# Altium schematic sheet STM32_QFP100_DEVELOPMENT_BOARD.SchDoc
size A4
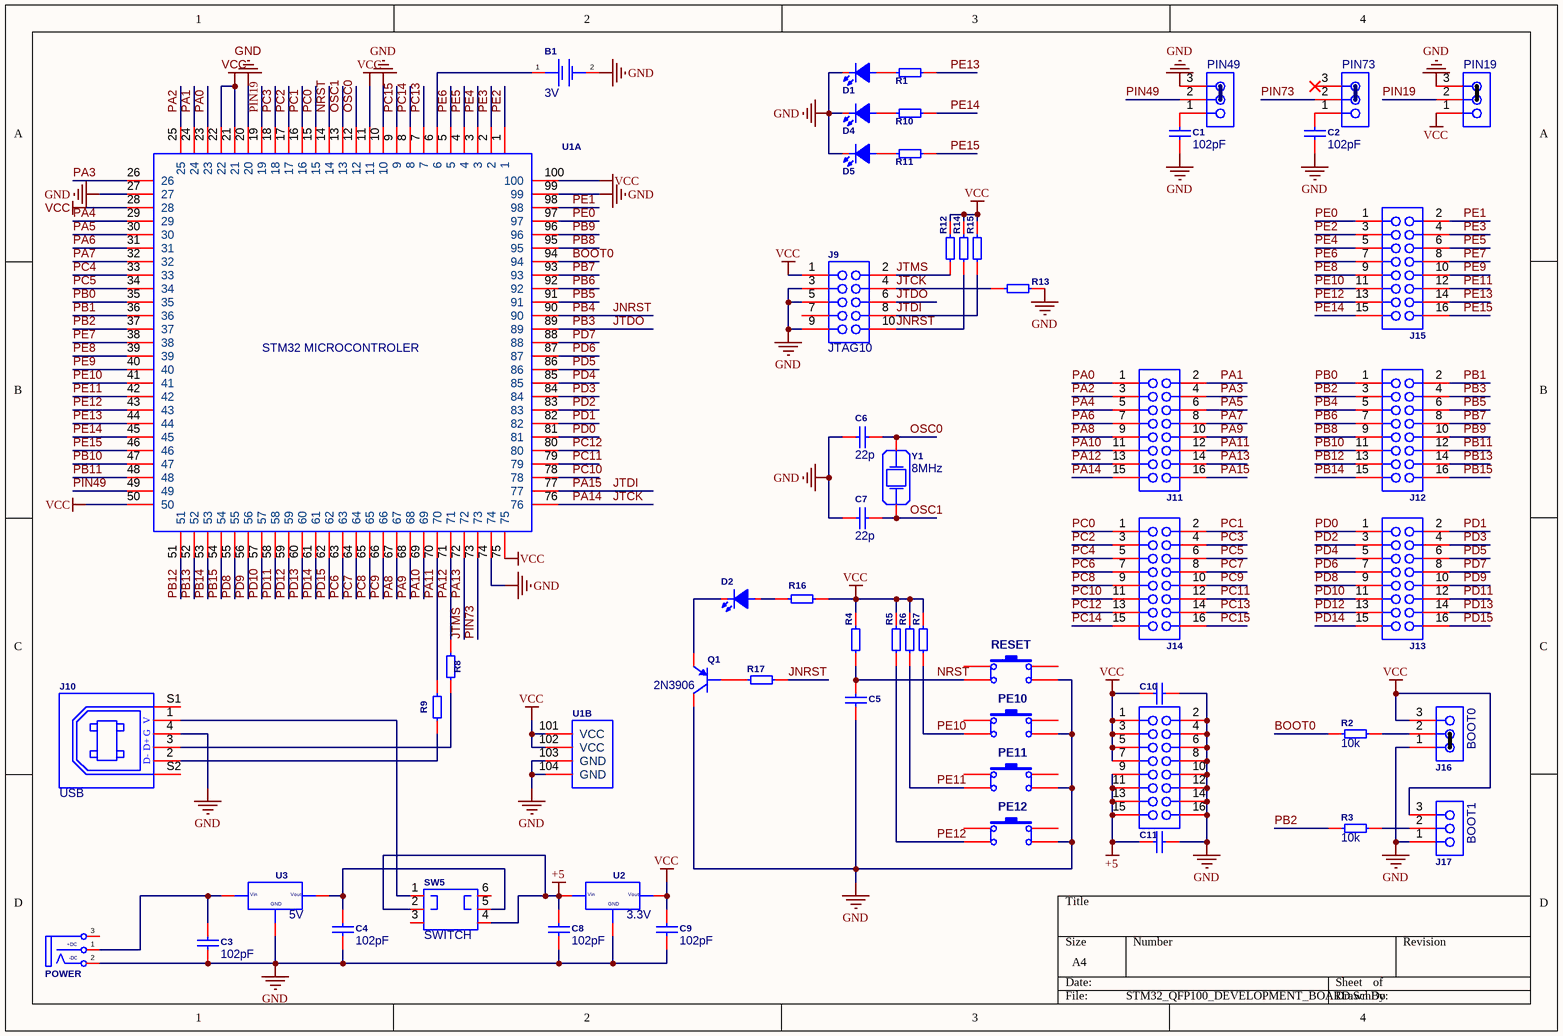
[diagram p0: STM32_QFP100_DEVELOPMENT_BOARD.SchDoc]

## Parts
B1  3V  [CR1220]
C1  102pF  [C0805]
C2  102pF  [C0805]
C3  102pF  [C1206]
C4  102pF  [C1206]
C5  104P  [C0805]  (value not drawn)
C6  22p  [C0805]
C7  22p  [C0805]
C8  102pF  [C1206]
C9  102pF  [C1206]
C10  102pF  [C1206]  (value not drawn)
C11  102pF  [C1206]  (value not drawn)
D1  PE13  [L0805RED]  (value not drawn)
D2  LED0805  [L0805RED]  (value not drawn)
D4  PE14  [L0805RED]  (value not drawn)
D5  PE15  [L0805RED]  (value not drawn)
J1  POWER  [Header 8x2 TH Pitch 2.54mm]  (value not drawn)
J3  PIN19  [Header 3x1 TH Pitch 2.54mm]
J5  PIN49  [Header 3x1 TH Pitch 2.54mm]
J6  PIN73  [Header 3x1 TH Pitch 2.54mm]
J9  JTAG10  [IDC_CONNECTOR_10x2.54]
J10  USB  [USB-B-TYPE]
J11  PORTA  [Header 8x2 TH Pitch 2.54mm]  (value not drawn)
J12  PORTB  [Header 8x2 TH Pitch 2.54mm]  (value not drawn)
J13  PORTD  [Header 8x2 TH Pitch 2.54mm]  (value not drawn)
J14  PORTC  [Header 8x2 TH Pitch 2.54mm]  (value not drawn)
J15  PORTE  [Header 8x2 TH Pitch 2.54mm]  (value not drawn)
J16  BOOT0  [Header 3x1 TH Pitch 2.54mm]
J17  BOOT1  [Header 3x1 TH Pitch 2.54mm]
POWER  Connector  [DC_K375A_Power]  (value not drawn)
Q1  2N3906  [SOT23-3]
R1  10k  [R0805]  (value not drawn)
R2  10k  [R0805]
R3  10k  [R0805]
R4  4K7  [R0805]  (value not drawn)
R5  4K7  [R0805]  (value not drawn)
R6  4K7  [R0805]  (value not drawn)
R7  4K7  [R0805]  (value not drawn)
R8  4K7  [R0805]  (value not drawn)
R9  4K7  [R0805]  (value not drawn)
R10  10k  [R0805]  (value not drawn)
R11  10k  [R0805]  (value not drawn)
R12  10k  [R0805]  (value not drawn)
R13  10k  [R0805]  (value not drawn)
R14  10k  [R0805]  (value not drawn)
R15  10k  [R0805]  (value not drawn)
R16  1K  [R0805]  (value not drawn)
R17  4K7  [R0805]  (value not drawn)
SW1  RESET  [BUTTON_HOLE_5.0mm]
SW2  PE10  [BUTTON_HOLE_5.0mm]
SW3  PE11  [BUTTON_HOLE_5.0mm]
SW4  PE12  [BUTTON_HOLE_5.0mm]
SW5  SWITCH  [SWITCH 5.8x5.8 6 PINS]
U1  STM32 MICROCONTROLER  [SOCKET-ADAPTER-OTQ-100-05-12]  (parts A,B of 2)
U2  3.3V  [SOT223-3]
U3  5V  [SOT223-3]
Y1  8MHz  [HC-49S]

## Nets
+5: C8.2 C11.2 J1.9 J1.11 J1.13 J1.15 SW5.2 SW5.4 U2.3
GND: B1.2 C1.1 C2.1 C3.1 C4.1 C5.1 C6.1 C7.1 C8.1 C9.1 C10.1 C11.1 D1.2(K) D4.2(K) D5.2(K) J1.2 J1.4 J1.6 J1.8 J1.10 J1.12 J1.14 J1.16 J3.3 J5.3 J9.3 J9.5 J9.9 J10.4 J16.1 J17.1 POWER.2(DC-) Q1.3(C) R13.1 SW1.4 SW2.4 SW3.4 SW4.4 U1.10 U1.20 U1.27 U1.74 U1.99 U1.103(GND) U1.104(GND) U2.1 U3.1
VCC: C9.2 C10.2 J1.1 J1.3 J1.5 J1.7 J3.1 J9.1 J16.3 J17.3 R4.1 R5.1 R6.1 R7.1 R12.1 R14.1 R15.1 R16.2 U1.11 U1.21 U1.22 U1.28 U1.50 U1.75 U1.100 U1.101(VCC) U1.102(VCC) U2.2
BOOT0: R2.2 U1.94
JNRST: J9.10 J12.5 R14.2 R17.2 U1.90  [also labelled PB4]
JTCK: J9.4 J11.15 R13.2 U1.76  [also labelled PA14]
JTDI: J9.8 J11.16 R15.2 U1.77  [also labelled PA15]
JTDO: J9.6 J12.4 U1.89  [also labelled PB3]
JTMS: J9.2 J11.14 R12.2 U1.72  [also labelled PA13]
NRST: C5.2 R4.2 SW1.2 U1.14
OSC0: C6.2 U1.12 Y1.2
OSC1: C7.2 U1.13 Y1.1
PA0: J11.1 U1.23
PA1: J11.2 U1.24
PA2: J11.3 U1.25
PA3: J11.4 U1.26
PA4: J11.5 U1.29
PA5: J11.6 U1.30
PA6: J11.7 U1.31
PA7: J11.8 U1.32
PA8: J11.9 U1.67
PA9: J11.10 U1.68
PA10: J11.11 U1.69
PA11: J11.12 R9.2 U1.70
PA12: J11.13 R8.2 U1.71
PB0: J12.1 U1.35
PB1: J12.2 U1.36
PB2: J12.3 R3.2 U1.37
PB5: J12.6 U1.91
PB6: J12.7 U1.92
PB7: J12.8 U1.93
PB8: J12.9 U1.95
PB9: J12.10 U1.96
PB10: J12.11 U1.47
PB11: J12.12 U1.48
PB12: J12.13 U1.51
PB13: J12.14 U1.52
PB14: J12.15 U1.53
PB15: J12.16 U1.54
PC0: J14.1 U1.15
PC1: J14.2 U1.16
PC2: J14.3 U1.17
PC3: J14.4 U1.18
PC4: J14.5 U1.33
PC5: J14.6 U1.34
PC6: J14.7 U1.63
PC7: J14.8 U1.64
PC8: J14.9 U1.65
PC9: J14.10 U1.66
PC10: J14.11 U1.78
PC11: J14.12 U1.79
PC12: J14.13 U1.80
PC13: J14.14 U1.7
PC14: J14.15 U1.8
PC15: J14.16 U1.9
PD0: J13.1 U1.81
PD1: J13.2 U1.82
PD2: J13.3 U1.83
PD3: J13.4 U1.84
PD4: J13.5 U1.85
PD5: J13.6 U1.86
PD6: J13.7 U1.87
PD7: J13.8 U1.88
PD8: J13.9 U1.55
PD9: J13.10 U1.56
PD10: J13.11 U1.57
PD11: J13.12 U1.58
PD12: J13.13 U1.59
PD13: J13.14 U1.60
PD14: J13.15 U1.61
PD15: J13.16 U1.62
PE0: J15.1 U1.97
PE1: J15.2 U1.98
PE2: J15.3 U1.1
PE3: J15.4 U1.2
PE4: J15.5 U1.3
PE5: J15.6 U1.4
PE6: J15.7 U1.5
PE7: J15.8 U1.38
PE8: J15.9 U1.39
PE9: J15.10 U1.40
PE10: J15.11 R7.2 SW2.2 U1.41
PE11: J15.12 R6.2 SW3.2 U1.42
PE12: J15.13 R5.2 SW4.2 U1.43
PE13: J15.14 R1.2 U1.44
PE14: J15.15 R10.2 U1.45
PE15: J15.16 R11.2 U1.46
PIN19: J3.2 U1.19
PIN49: J5.2 U1.49
PIN73: J6.2 U1.73
NetB1_1: B1.1 U1.6
NetC1_2: C1.2 J5.1
NetC2_2: C2.2 J6.1
NetC3_2: C3.2 POWER.1(DS+) U3.3
NetC4_2: C4.2 SW5.5 U3.2
NetD1_1: D1.1(A) R1.1
NetD2_1: D2.1(A) R16.1
NetD2_2: D2.2(K) Q1.2(E)
NetD4_1: D4.1(A) R10.1
NetD5_1: D5.1(A) R11.1
NetJ10_1: J10.1 SW5.1
NetJ10_2: J10.2 R9.1
NetJ10_3: J10.3 R8.1
NetJ16_2: J16.2 R2.1
NetJ17_2: J17.2 R3.1
NetQ1_1: Q1.1(B) R17.1

Not connected (* = marked no-connect by the designer): J6 3*; J9 7; J10 S1 S2; POWER 3(T); SW1 1 3; SW2 1 3; SW3 1 3; SW4 1 3; SW5 3 6

## Notes on the sheet
- (in symbol AMS1117(SOT-223)) Vin; Vout; GND
- (in symbol JackDC) +DC; -DC
- (in symbol USB B Type) V; G; D+; D-

## Library data of the parts
B1 = Batery
C1-C4 C8-C11 = Capacitors(SMD)
C5-C7 = C0805
D1 D4 D5 = LED0805
J1 J11-J15 = Header 8x2 TH Pitch 2.54mm
J3 J5 J6 J16 J17 = Header 3x1 TH Pitch 2.54mm
J9 = IDC_2.54_5x2
J10 = USB B Type
POWER = JackDC
Q1 = 2N3906 (SOT-23)
R1-R17 = Resistor SMD
SW1-SW4 = Button Hole
SW5 = SWITCH-DPDT
U1 = SOCKET-ADAPTER-OTQ-100-05-12
U2 U3 = AMS1117(SOT-223)
Y1 = Crystal